# Altium schematic sheet 1_Interface.SchDoc
size A4; Organization: SpaceLab UFSC; Address1: UFSC - SpaceLab; Address2: University Campus - Trindade; Address3: Dep. of Electrical Engineering - CTC; Address4: Florianópolis, Santa Catarina, Brazil; Address5: CEP: 88040 - 900
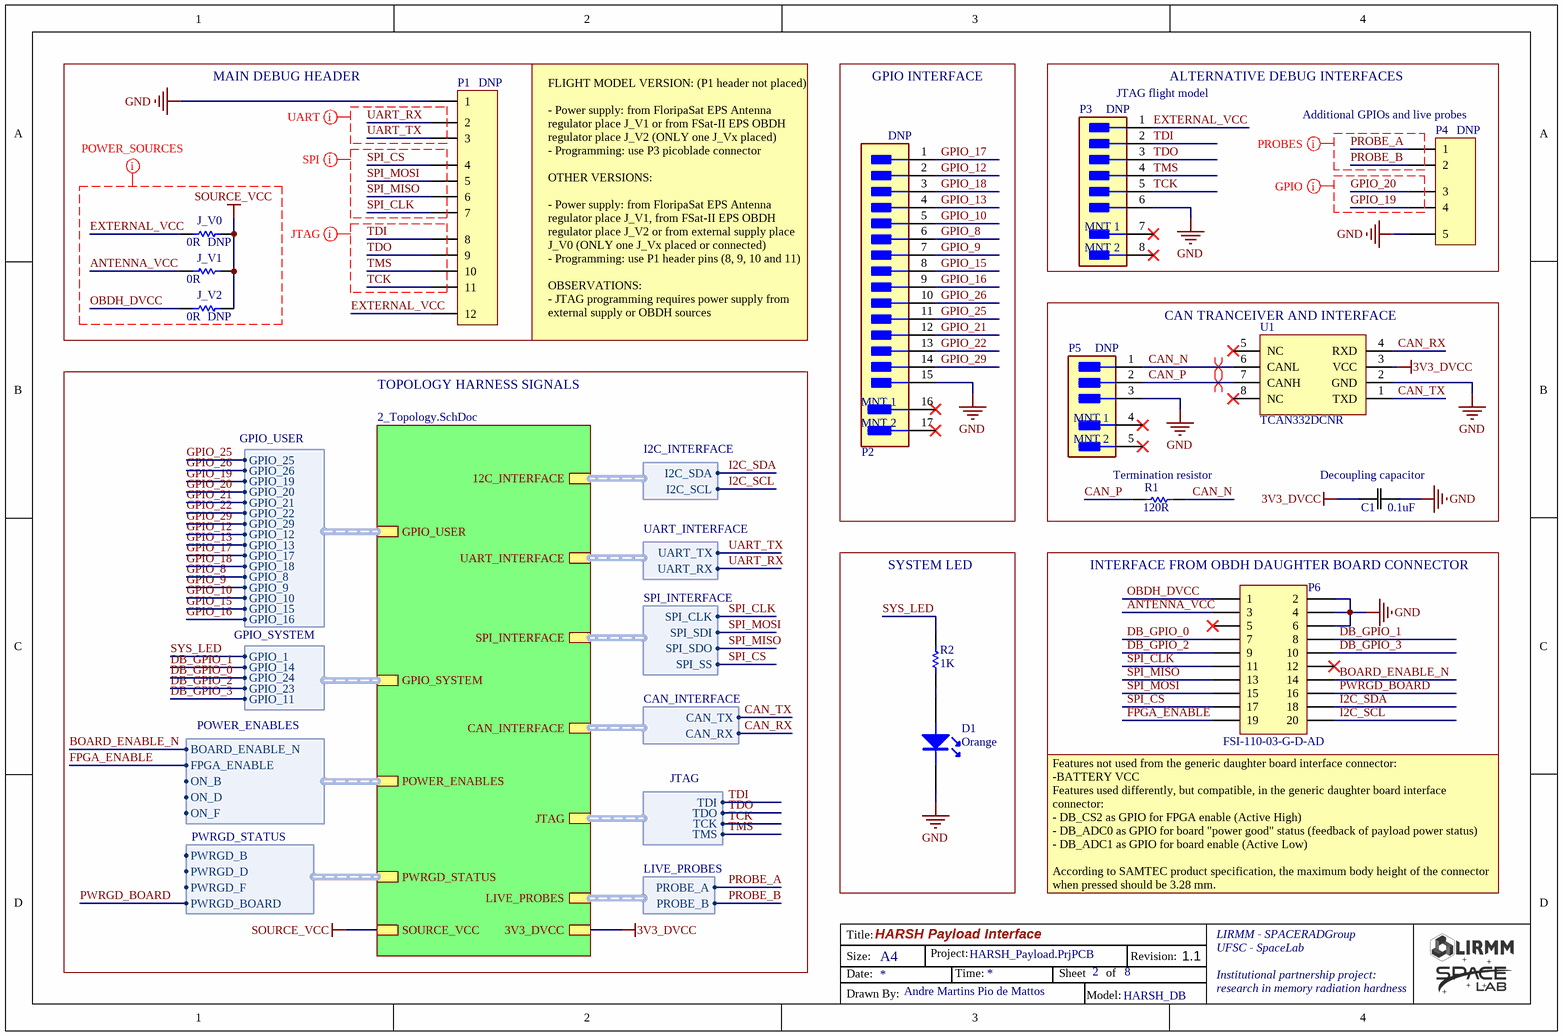
[diagram p0: 1_Interface.SchDoc]

## Parts
C1  Capacitance: 0.1uF  [DONE_C0603]  (hidden comment: 100nF/50V)
D1  Orange  [DONE_D0603_ORANGE]
J_V0  0R  [DONE_R0603]
J_V1  0R  [DONE_R0603]
J_V2  0R  [DONE_R0603]
P1  Header 12H  [DONE_H1X12_PADS]  (value not drawn)
P2  53261-1571  [DONE_PICOBLADE_15H_HORIZONTAL]  (value not drawn)
P3  53261-0671  [DONE_PICOBLADE_6H_HORIZONTAL]  (value not drawn)
P4  Header 5H  [DONE_H1X5_PADS]  (value not drawn)
P5  53261-0371  [DONE_PICOBLADE_3H_HORIZONTAL]  (value not drawn)
P6  FSI-110-03-G-D-AD  [DONE_DB_INTERFACE]
R1  120R  [DONE_R0603]
R2  1K  [DONE_R0603]
U1  TCAN332DCNR  [DONE_TSOT_23_8]

## Blocks framed on the sheet
MAIN DEBUG HEADER: J_V0-J_V2 P1
GPIO INTERFACE: P2
ALTERNATIVE DEBUG INTERFACES: P3 P4
CAN TRANCEIVER AND INTERFACE: C1 P5 R1 U1
SYSTEM LED: D1 R2
INTERFACE FROM OBDH DAUGHTER BOARD CONNECTOR: P6

## Sub-sheets
Topology = 2_Topology.SchDoc: UART_INTERFACE (harness UART_INTERFACE), POWER_ENABLES (harness POWER_ENABLES), GPIO_USER (harness GPIO_USER), GPIO_SYSTEM (harness GPIO_SYSTEM), CAN_INTERFACE (harness CAN_INTERFACE), 12C_INTERFACE (harness I2C_INTERFACE), 3V3_DVCC, SOURCE_VCC, SPI_INTERFACE (harness SPI_INTERFACE), PWRGD_STATUS (harness PWRGD_STATUS), JTAG (harness JTAG), LIVE_PROBES (harness LIVE_PROBES)

## Harnesses
CAN_INTERFACE: CAN_TX, CAN_RX
SPI_INTERFACE: SPI_SDO, SPI_SDI, SPI_SS, SPI_CLK
I2C_INTERFACE: I2C_SDA, I2C_SCL
UART_INTERFACE: UART_TX, UART_RX
JTAG: TMS, TCK, TDO, TDI
GPIO_USER: GPIO_25, GPIO_26, GPIO_19, GPIO_20, GPIO_21, GPIO_22, GPIO_29, GPIO_12, GPIO_13, GPIO_17, GPIO_18, GPIO_8, GPIO_9, GPIO_10, GPIO_15, GPIO_16
LIVE_PROBES: PROBE_A, PROBE_B
GPIO_SYSTEM: GPIO_1, GPIO_14, GPIO_24, GPIO_23, GPIO_11
POWER_ENABLES: FPGA_ENABLE, ON_B, BOARD_ENABLE_N, ON_D, ON_F
PWRGD_STATUS: PWRGD_B, PWRGD_D, PWRGD_F, PWRGD_BOARD

## Nets
3V3_DVCC: C1.1 U1.3(VCC) ; sheet Topology/3V3_DVCC
GND: C1.2 D1.2(K) P1.1 P2.15 P3.6 P4.5 P5.3 P6.2 P6.4 P6.6 U1.2(GND)
SOURCE_VCC: J_V0.1 J_V1.1 J_V2.1 ; sheet Topology/SOURCE_VCC
ANTENNA_VCC: J_V1.2 P6.3
BOARD_ENABLE_N: P6.14 ; sheet Topology/POWER_ENABLES.BOARD_ENABLE_N
CAN_N: P5.1 R1.1 U1.6(CANL)
CAN_P: P5.2 R1.2 U1.7(CANH)
CAN_RX: U1.4(RXD) ; sheet Topology/CAN_INTERFACE.CAN_RX
CAN_TX: U1.1(TXD) ; sheet Topology/CAN_INTERFACE.CAN_TX
DB_GPIO_0: P6.7 ; sheet Topology/GPIO_SYSTEM.GPIO_24
DB_GPIO_1: P6.8 ; sheet Topology/GPIO_SYSTEM.GPIO_14
DB_GPIO_2: P6.9 ; sheet Topology/GPIO_SYSTEM.GPIO_23
DB_GPIO_3: P6.10 ; sheet Topology/GPIO_SYSTEM.GPIO_11
EXTERNAL_VCC: J_V0.2 P1.12 P3.1
FPGA_ENABLE: P6.19 ; sheet Topology/POWER_ENABLES.FPGA_ENABLE
GPIO_8: P2.6 ; sheet Topology/GPIO_USER.GPIO_8
GPIO_9: P2.7 ; sheet Topology/GPIO_USER.GPIO_9
GPIO_10: P2.5 ; sheet Topology/GPIO_USER.GPIO_10
GPIO_12: P2.2 ; sheet Topology/GPIO_USER.GPIO_12
GPIO_13: P2.4 ; sheet Topology/GPIO_USER.GPIO_13
GPIO_15: P2.8 ; sheet Topology/GPIO_USER.GPIO_15
GPIO_16: P2.9 ; sheet Topology/GPIO_USER.GPIO_16
GPIO_17: P2.1 ; sheet Topology/GPIO_USER.GPIO_17
GPIO_18: P2.3 ; sheet Topology/GPIO_USER.GPIO_18
GPIO_19: P4.4 ; sheet Topology/GPIO_USER.GPIO_19
GPIO_20: P4.3 ; sheet Topology/GPIO_USER.GPIO_20
GPIO_21: P2.12 ; sheet Topology/GPIO_USER.GPIO_21
GPIO_22: P2.13 ; sheet Topology/GPIO_USER.GPIO_22
GPIO_25: P2.11 ; sheet Topology/GPIO_USER.GPIO_25
GPIO_26: P2.10 ; sheet Topology/GPIO_USER.GPIO_26
GPIO_29: P2.14 ; sheet Topology/GPIO_USER.GPIO_29
I2C_SCL: P6.20 ; sheet Topology/12C_INTERFACE.I2C_SCL
I2C_SDA: P6.18 ; sheet Topology/12C_INTERFACE.I2C_SDA
OBDH_DVCC: J_V2.2 P6.1
PROBE_A: P4.1 ; sheet Topology/LIVE_PROBES.PROBE_A
PROBE_B: P4.2 ; sheet Topology/LIVE_PROBES.PROBE_B
PWRGD_BOARD: P6.16 ; sheet Topology/PWRGD_STATUS.PWRGD_BOARD
SPI_CLK: P1.7 P6.11 ; sheet Topology/SPI_INTERFACE.SPI_CLK
SPI_CS: P1.4 P6.17 ; sheet Topology/SPI_INTERFACE.SPI_SS
SPI_MISO: P1.6 P6.13 ; sheet Topology/SPI_INTERFACE.SPI_SDO
SPI_MOSI: P1.5 P6.15 ; sheet Topology/SPI_INTERFACE.SPI_SDI
SYS_LED: R2.2 ; sheet Topology/GPIO_SYSTEM.GPIO_1
TCK: P1.11 P3.5 ; sheet Topology/JTAG.TCK
TDI: P1.8 P3.2 ; sheet Topology/JTAG.TDI
TDO: P1.9 P3.3 ; sheet Topology/JTAG.TDO
TMS: P1.10 P3.4 ; sheet Topology/JTAG.TMS
UART_RX: P1.2 ; sheet Topology/UART_INTERFACE.UART_RX
UART_TX: P1.3 ; sheet Topology/UART_INTERFACE.UART_TX
NetD1_1: D1.1(A) R2.1

Not connected (* = marked no-connect by the designer): P2 16(MNT_1)* 17(MNT_2)*; P3 7(MNT_1)* 8(MNT_2)*; P5 4(MNT_1)* 5(MNT_2)*; P6 5* 12*; U1 5(NC)* 8(NC)*

## Layout directives
net class NetClass: ANTENNA_VCC, EXTERNAL_VCC, GPIO_19, GPIO_20, OBDH_DVCC, PROBE_A, PROBE_B, SOURCE_VCC, SPI_CLK, SPI_CS, SPI_MISO, SPI_MOSI, TCK, TDI, TDO, TMS, UART_RX, UART_TX
differential pair: CAN_N, CAN_P

## Notes on the sheet
- (near P1) DNP
- (near P3) DNP
- (near P3) JTAG flight model
- (near P2) DNP
- (near P4) Additional GPIOs and live probes
- (near P4) DNP
- (near J_V0) DNP
- (near J_V2) DNP
- FLIGHT MODEL VERSION: (P1 header not placed)
  - Power supply: from FloripaSat EPS Antenna regulator place J_V1 or from FSat-II EPS OBDH regulator place J_V2 (ONLY one J_Vx placed)
  - Programming: use P3 picoblade connector
  OTHER VERSIONS:
  - Power supply: from FloripaSat EPS Antenna regulator place J_V1, from FSat-II EPS OBDH regulator place J_V2 or from external supply place J_V0 (ONLY one J_Vx placed or connected)
  - Programming: use P1 header pins (8, 9, 10 and 11)
  OBSERVATIONS:
  - JTAG programming requires power supply from external supply or OBDH sources
- (near P5) DNP
- TOPOLOGY HARNESS SIGNALS
- Termination resistor
- (near C1) Decoupling capacitor
- (near P6) Features not used from the generic daughter board interface connector:
  -BATTERY VCC
  Features used differently, but compatible, in the generic daughter board interface connector:
  - DB_CS2 as GPIO for FPGA enable (Active High)
  - DB_ADC0 as GPIO for board "power good" status (feedback of payload power status)
  - DB_ADC1 as GPIO for board enable (Active Low)
  According to SAMTEC product specification, the maximum body height of the connector when pressed should be 3.28 mm.
- HARSH Payload Interface
- HARSH_Payload.PrjPCB
- 2
- 8
- 1.1
- Andre Martins Pio de Mattos
- HARSH_DB
- Title:
- Size:
- Date:
- A4
- Project:
- Time:
- Sheet
- of
- Revision:
- LIRMM - SPACERADGroup
- UFSC - SpaceLab
- Institutional partnership project:
- research in memory radiation hardness
- Drawn By:
- Model:

## Library data of the parts
C1 = DONE_CAP_0.1uF_0603_X7R: CAP CER 100nF 50V 0603 10%; Partnumber: C0603C104K5RAC3121; Manufacturer: Yageo; Dielectric: X7R; NCM: 8532.24.10; ComponentLink1Description: https://www.digikey.com/product-detail/en/yageo/CC0201KRX7R9BB101/311-1401-1-ND/2833707; ComponentLink1URL: https://www.digikey.com/product-detail/en/yageo/CC0201KRX7R9BB101/311-1401-1-ND/2833707; ComponentLink2Description: https://br.mouser.com/ProductDetail/Yageo/CC0201KRX7R9BB101?qs=%2Fha2pyFaduiYipKOFrxfqt3%252B9aGSfhofiweIoBBppi5CkwQHqUahpQ%3D%3D; ComponentLink2URL: https://br.mouser.com/ProductDetail/Yageo/CC0201KRX7R9BB101?qs=%2Fha2pyFaduiYipKOFrxfqt3%252B9aGSfhofiweIoBBppi5CkwQHqUahpQ%3D%3D; Supplier 1: Digi-Key; Supplier Part Number 1: 311-1401-1-ND; Stock 1: 203642; Pricing 1: 1=0.1, 10=0.017, 100=0.0078, 500=0.00554, 1000=0.00436, 2500=0.00396, 5000=0.00364 (USD); Mount: Surface Mount; Case/Package: 0201; Weight: 6E-06oz; Case Code (Metric): 0603; Case Code (Imperial): 0201; Min Operating Temperature: -55°C; Max Operating Temperature: 125°C; Tolerance: 10%; Package Quantity: 1; Voltage Rating: 50V; Packaging: Tape and Reel; Voltage Rating (DC): 50V; Termination: SMD/SMT; Composition: Ceramic; Length: 0.6mm; Height: 0.3mm; Width: 0.012inch; Thickness: 0.013inch; Depth: 0.3mm; Radiation Hardening: No; Lead Free: Lead Free; Halogen Free: Halogen Free; ComponentLink3URL: http://www.yageo.com/documents/recent/UPY-GPHC_X7R_6.3V-to-50V_18.pdf?src-supplier=Digi-Key; ComponentLink3Description: http://www.yageo.com/documents/recent/UPY-GPHC_X7R_6.3V-to-50V_18.pdf?src-supplier=Digi-Key; ComponentLink4URL: http://www.yageo.com/documents/recent/UPY-GPHC_X7R_6.3V-to-50V_8.pdf?src-supplier=Avnet+Europe; ComponentLink4Description: http://www.yageo.com/documents/recent/UPY-GPHC_X7R_6.3V-to-50V_8.pdf?src-supplier=Avnet+Europe; ComponentLink5URL: http://www.yageo.com/documents/recent/UPY-GPHC_X7R_6.3V-to-50V_8.pdf?src-supplier=Avnet; ComponentLink5Description: http://www.yageo.com/documents/recent/UPY-GPHC_X7R_6.3V-to-50V_8.pdf?src-supplier=Avnet; ComponentLink6URL: http://www.mouser.com/ds/2/447/Yageo_UPY-GP_NP0_16V-to-50V_9-358835.pdf?src-supplier=Mouser; ComponentLink6Description: http://www.mouser.com/ds/2/447/Yageo_UPY-GP_NP0_16V-to-50V_9-358835.pdf?src-supplier=Mouser; Supplier 2: Mouser; Supplier Part Number 2: 603-CC201KRX7R9BB101; Stock 2: 51204; Pricing 2: 1=0.1, 10=0.024, 100=0.011, 1000=0.009, 2500=0.006, 10000=0.006 (USD)
D1 = DONE_LED_ORANGE_0603: SMD Orange LED; Partnumber: HSML-C191-T0000; ComponentLink1Description: https://www.digikey.com/product-detail/en/lite-on-inc/LTST-C170KFKT/160-1413-1-ND/386774; ComponentLink1URL: https://www.digikey.com/product-detail/en/lite-on-inc/LTST-C170KFKT/160-1413-1-ND/386774; ComponentLink2Description: https://br.mouser.com/ProductDetail/Lite-On/LTST-C170KFKT?qs=%2Fha2pyFadugHsX7bdQzWjMrioqtf8F%2FEFUVxYkqdVx%252BrRWuVMVludQ%3D%3D; ComponentLink2URL: https://br.mouser.com/ProductDetail/Lite-On/LTST-C170KFKT?qs=%2Fha2pyFadugHsX7bdQzWjMrioqtf8F%2FEFUVxYkqdVx%252BrRWuVMVludQ%3D%3D; ComponentLink3URL: https://www.verical.com/server-webapp/html/getDatasheet?partID=158266&src-supplier=Verical; ComponentLink3Description: https://www.verical.com/server-webapp/html/getDatasheet?partID=158266&src-supplier=Verical; ComponentLink4URL: http://optoelectronics.liteon.com/upload/download/DS-22-99-0185/LTST-C170KFKT.pdf?src-supplier=Digi-Key; ComponentLink4Description: http://optoelectronics.liteon.com/upload/download/DS-22-99-0185/LTST-C170KFKT.pdf?src-supplier=Digi-Key; ComponentLink5URL: http://www1.futureelectronics.com/doc/LITE-ON/LTST-C170KFKT.pdf?src-supplier=Future+Electronics; ComponentLink5Description: http://www1.futureelectronics.com/doc/LITE-ON/LTST-C170KFKT.pdf?src-supplier=Future+Electronics; ComponentLink6URL: http://www.mouser.com/ds/2/239/Lite-On-LTST-C170KFKT-187690.pdf?src-supplier=Mouser; ComponentLink6Description: http://www.mouser.com/ds/2/239/Lite-On-LTST-C170KFKT-187690.pdf?src-supplier=Mouser
J_V0-J_V2 = DONE_RES_0R_0603: RES SMD 0 OHM JUMPER 1/10W 0603; Partnumber: RC0603JR-070RL; Case Code (Imperial): 0603; ComponentLink1URL: http://www.mouser.com/ds/2/427/mcat_pro-223602.pdf; ComponentLink1Description: http://www.mouser.com/ds/2/427/mcat_pro-223602.pdf; ComponentLink2URL: http://www.vishay.com/docs/28760/mcat_pro.pdf; ComponentLink2Description: http://www.vishay.com/docs/28760/mcat_pro.pdf
P1 = DONE_H1X12_PADS: Header, 12-Pin; LatestRevisionDate: 17-Jul-2002; LatestRevisionNote: Re-released for DXP Platform.; Publisher: Altium Limited
P2 = DONE_PICOBLADE_15H: Picoblade, 15 pos, Right-angle, 53261-1571; Partnumber: 53261-1571
P3 = DONE_PICOBLADE_6H: Picoblade, 6 pos, Right-angle; Partnumber: 53261-0671
P4 = DONE_H1X5_PADS: Header, 5-Pin, Pads; LatestRevisionDate: 17-Jul-2002; LatestRevisionNote: Re-released for DXP Platform.; Publisher: Altium Limited
P5 = DONE_PICOBLADE_3H: Picoblade, 3 pos, Right-angle; Partnumber: 53261-0371
P6 = DONE_DB_INTERFACE: CONN STACKING 20POS SMD GOLD; Manufacturer: Samtec; Number of Contacts: 20; Gender: Male; Pitch: 1mm; Value: *; Partnumber: FSI-110-03-G-D-AD; ComponentLink1Description: https://www.digikey.com/product-detail/en/samtec-inc/FSI-110-03-G-D-AD/SAM9412-ND/6678149; ComponentLink1URL: https://www.digikey.com/product-detail/en/samtec-inc/FSI-110-03-G-D-AD/SAM9412-ND/6678149; ComponentLink2Description: https://br.mouser.com/ProductDetail/Samtec/FSI-110-03-G-D-AD?qs=sGAEpiMZZMvffgRu4KC1RxM6nKwEP14AvPoIU%2FGiIRnIunfAN0MvNQ%3D%3D; ComponentLink2URL: https://br.mouser.com/ProductDetail/Samtec/FSI-110-03-G-D-AD?qs=sGAEpiMZZMvffgRu4KC1RxM6nKwEP14AvPoIU%2FGiIRnIunfAN0MvNQ%3D%3D; Supplier 1: Digi-Key; Supplier Part Number 1: SAM9412-ND; Stock 1: 100; Pricing 1: 1=6.6, 10=6.325, 25=5.7752, 50=5.5, 100=5.225, 250=4.675, 500=4.4, 1000=3.85, 2500=3.6575 (USD); Mount: Surface Mount; Contact Plating: Gold; Contact Material: Copper; Number of Rows: 2; Termination: Solder; Radiation Hardening: No; REACH SVHC: No SVHC; ComponentLink3URL: http://www.samtec.com/ftppub/pdf/FSI_03.PDF?src-supplier=Avnet+Europe; ComponentLink3Description: http://www.samtec.com/ftppub/pdf/FSI_03.PDF?src-supplier=Avnet+Europe; Supplier 2: Mouser; Supplier Part Number 2: 200-FSI11003GDAD; Stock 2: 50; Pricing 2: 1=6.59, 10=5.5, 100=4.68, 250=4.17, 500=3.84, 1000=3.6 (USD); Manufacturer Part Number: FSI-110-03-G-D-AD
R1 = DONE_RES_120R_0603: 120R 1% 0603; Partnumber: RC0603FR-07120RL; Resistance: 120R
R2 = DONE_RES_1K_0603: RES SMD 1K OHM 1% 1/4W 0603; Manufacturer: Rohm; Manufacturer Part Number: ESR03EZPF1001; Power Rating: 250mW; Temperature Coefficient: 100ppm/°C; ComponentLink1Description: digikey; ComponentLink1URL: https://www.digikey.com/product-detail/en/rohm-semiconductor/ESR03EZPF1001/RHM1.00KADCT-ND/1983752; Supplier 1: Digi-Key; Stock 1: 24170; Pricing 1: 1=0.14, 10=0.126, 100=0.0484, 1000=0.0213, 2500=0.0184 (USD); Case/Package: 0603; Case Code (Metric): 1608; Case Code (Imperial): 0603; Min Operating Temperature: -55°C; Max Operating Temperature: 155°C; Package Quantity: 1; Tolerance: 1%; Packaging: Tape and Reel; Composition: Thick Film; Number of Terminations: 2; Max Power Dissipation: 250mW; Length: 0.063inch; Height: 0.022inch; Width: 0.031inch; Lead Free: Lead Free; ComponentLink2URL: https://datasheet.ciiva.com/2469/esr-2469712.pdf; ComponentLink2Description: https://datasheet.ciiva.com/2469/esr-2469712.pdf; ComponentLink3URL: https://datasheet.ciiva.com/2469/esr-2469713.pdf; ComponentLink3Description: https://datasheet.ciiva.com/2469/esr-2469713.pdf; ComponentLink4URL: https://datasheet.ciiva.com/2469/esr-2469714.pdf; ComponentLink4Description: https://datasheet.ciiva.com/2469/esr-2469714.pdf; Supplier Part Number 1: RHM1.00KADCT-ND; Resistance: 1K; Partnumber: ESR03EZPF1001
U1 = DONE_TCAN332DCNR: Tranceiver CAN, 8-pin SOT23; Manufacturer: Texas Instruments; Mounting Technology: Surface Mount; ComponentLink1Description: Manufacturer URL; ComponentLink2Description: Datasheet; ComponentLink3URL: http://cds.linear.com/docs/en/packaging/SOT_8_05-08-1637.pdf; ComponentLink1URL: http://www.linear.com/; ComponentLink2URL: http://cds.linear.com/docs/en/datasheet/436112fb.pdf; ComponentLink3Description: Package Specification; PackageDescription: 8-Pin Plastic TSOT-23, Body 2.9 x 1.63 mm, Pitch 0.65 mm; PartNumber: TCAN332DCNR